# Altium project WashrProgV1.PrjPcb
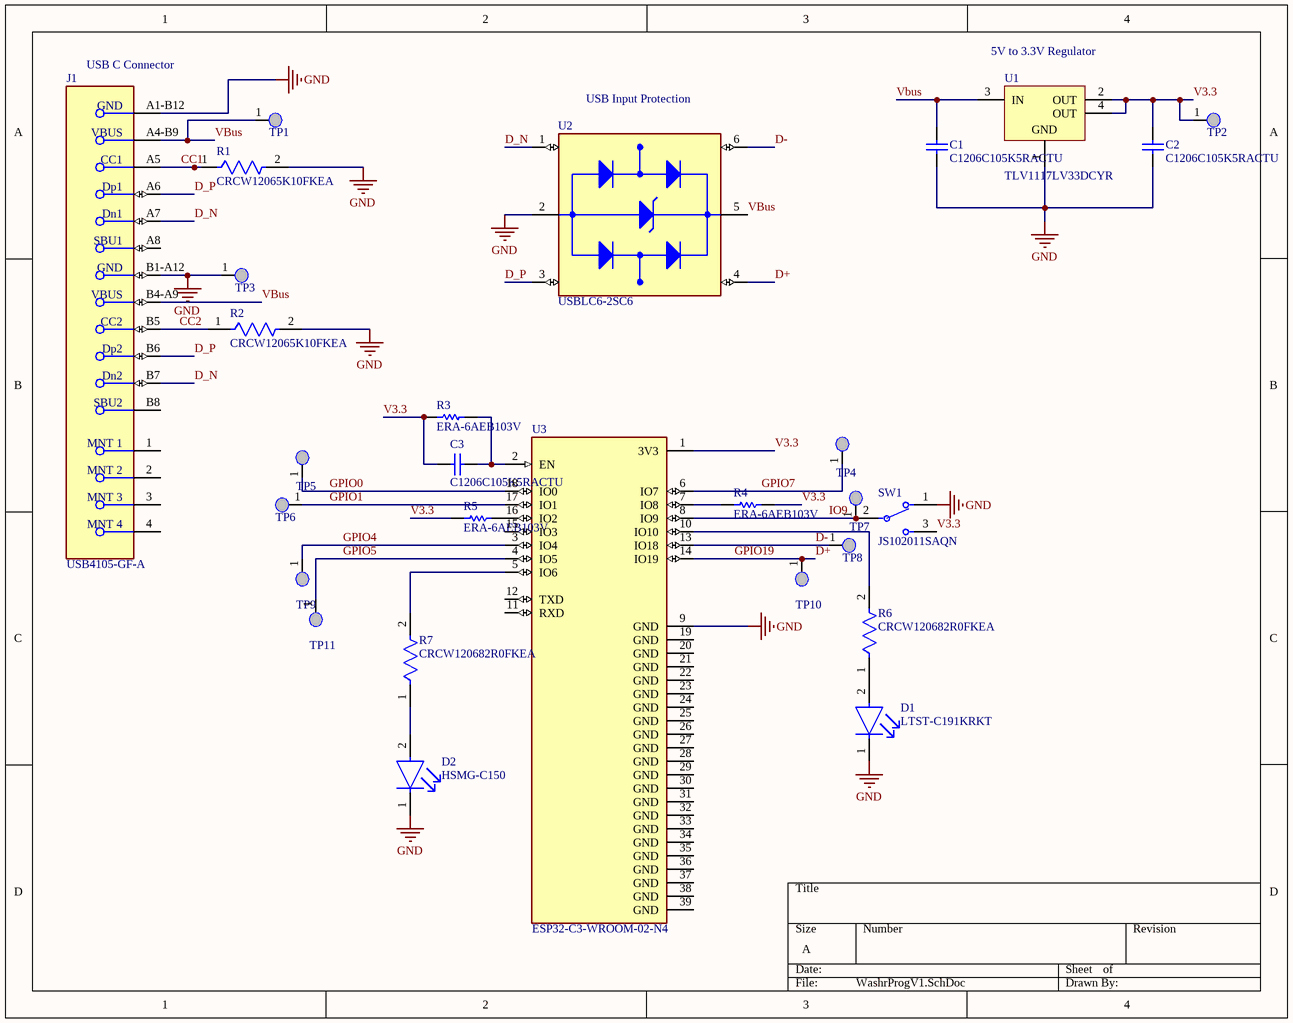
[diagram p0: WashrProgV1.SchDoc]
1 sheet, 28 parts. Net scope: global (net labels, ports and power ports of the same name join across sheets).
Board file: WashrProgV1.PcbDoc

## Sheet WashrProgV1.SchDoc
size A; SheetNumber: 1; SheetTotal: 1

### Parts
C1  C1206C105K5RACTU  [CAPC3216X110X50LL20T25]
C2  C1206C105K5RACTU  [CAPC3216X110X50LL20T25]
C3  C1206C105K5RACTU  [CAPC3216X110X50LL20T25]
D1  LTST-C191KRKT  [FP-LTST-C191KRKT-MFG]
D2  HSMG-C150  [FP-HSMG-C150-MFG]
J1  USB4105-GF-A  [FP-USB4105-GF-A-MFG]
R1  CRCW12065K10FKEA  [FP-CRCW1206-e3-IPC_C]
R2  CRCW12065K10FKEA  [FP-CRCW1206-e3-IPC_C]
R3  ERA-6AEB103V  [RESC2013X60X40LL20T25_A]
R4  ERA-6AEB103V  [RESC2013X60X40LL20T25_A]
R5  ERA-6AEB103V  [RESC2013X60X40LL20T25_A]
R6  CRCW120682R0FKEA  [FP-CRCW1206-e3-IPC_A]
R7  CRCW120682R0FKEA  [FP-CRCW1206-e3-IPC_A]
SW1  JS102011SAQN  [FP-JS102011SAQN-MFG]
TP1  Testpin  [PCBComponent_1]  (value not drawn)  (no BOM)
TP2  Testpin  [PCBComponent_1]  (value not drawn)  (no BOM)
TP3  Testpin  [PCBComponent_1]  (value not drawn)  (no BOM)
TP4  Testpin  [PCBComponent_1]  (value not drawn)  (no BOM)
TP5  Testpin  [PCBComponent_1]  (value not drawn)  (no BOM)
TP6  Testpin  [PCBComponent_1]  (value not drawn)  (no BOM)
TP7  Testpin  [PCBComponent_1]  (value not drawn)  (no BOM)
TP8  Testpin  [PCBComponent_1]  (value not drawn)  (no BOM)
TP9  Testpin  [PCBComponent_1]  (value not drawn)  (no BOM)
TP10  Testpin  [PCBComponent_1]  (value not drawn)  (no BOM)
TP11  Testpin  [PCBComponent_1]  (value not drawn)  (no BOM)
U1  TLV1117LV33DCYR  [DCY0004A_N]
U2  USBLC6-2SC6  [SOT95P280X145-6N]
U3  ESP32-C3-WROOM-02-N4  [MODULE_ESP32-C3-WROOM-02-H4]

### Nets
GND: C1.1 C2.1 D1.1(C) D2.1(C) J1.A1-B12(GND) J1.B1-A12(GND) R1.2 R2.2 SW1.1 TP3.1(TestPin) U1.1(GND) U2.2(GND) U3.9(GND)
CC1: J1.A5(CC1) R1.1
CC2: J1.B5(CC2) R2.1
D+: TP10.1(TestPin) U2.4(I/O2_OUT) U3.14(IO19)  [also labelled GPIO19]
D-: TP8.1(TestPin) U2.6(I/O1_OUT) U3.13(IO18)
D_N: J1.A7(Dn1) J1.B7(Dn2) U2.1(I/O1_IN)
D_P: J1.A6(Dp1) J1.B6(Dp2) U2.3(I/O2_IN)
GPIO0: TP5.1(TestPin) U3.18(IO0)
GPIO1: TP6.1(TestPin) U3.17(IO1)
GPIO4: TP9.1(TestPin) U3.3(IO4)
GPIO5: TP11.1(TestPin) U3.4(IO5)
GPIO7: TP4.1(TestPin) U3.6(IO7)
IO9: SW1.2(C) TP7.1(TestPin) U3.8(IO9)
V3.3: C2.2 C3.2 R3.1 R4.2 R5.2 SW1.3 TP2.1(TestPin) U1.2(OUT) U1.4(OUT) U3.1(3V3)
VBus: C1.2 J1.A4-B9(VBUS) J1.B4-A9(VBUS) TP1.1(TestPin) U1.3(IN) U2.5(VBUS)
NetC3_1: C3.1 R3.2 U3.2(EN)
NetD1_2: D1.2(A) R6.1
NetD2_2: D2.2(A) R7.1
NetR4_1: R4.1 U3.7(IO8)
NetR5_1: R5.1 U3.16(IO2)
NetR6_2: R6.2 U3.10(IO10)
NetR7_2: R7.2 U3.5(IO6)

Not connected (* = marked no-connect by the designer): J1 1(MNT_1) 2(MNT_2) 3(MNT_3) 4(MNT_4) A8(SBU1) B8(SBU2); U3 11(RXD) 12(TXD) 15(IO3) 19(GND) 20(GND) 21(GND) 22(GND) 23(GND) 24(GND) 25(GND) 26(GND) 27(GND) 28(GND) 29(GND) 30(GND) 31(GND) 32(GND) 33(GND) 34(GND) 35(GND) 36(GND) 37(GND) 38(GND) 39(GND)

### Notes on the sheet
- (near J1) USB C Connector
- (near U2) USB Input Protection
- (near U1) 5V to 3.3V Regulator

### Library data of the parts
C1-C3 = CMP-2000-06011-1: Chip Capacitor, 1 uF, +/- 10%, 50 V, -55 to 125 degC, 1206 (3216 Metric), RoHS, Tape and Reel; Manufacturer: Kemet; Case Height: 1mm; Dielectric: X7R; Voltage Rating: 50V; Capacitance: 1uF; Temperature Coefficient / Code: +/-15%; Case Length: 3.2mm; Case Width: 1.6mm; Type: SMDMLCCX7R6.3-250VDCCommericalGrade; Class: Class1; Capacitance - nF: 1000nF; Datasheet URL: http://www.kemet.com/docfinder?Partnumber=C1206C105K5RACTU; Product Category: MultilayerCeramicCapacitorsMLCC-SMD/SMT; Termination Style: SMD/SMT; Dimensions: 1.6mmWx3.2mmLx1mmH; Voltage Rating DC: 50V; Datasheet Version: 02/2016; Packaging: Reel; Brand: Kemet; RoHS: Details; Minimum Operating Temperature: -55C; Operating Temperature Range: -55Cto+125C; Package Reference: 1206; Manufacturer URL: http://www.kemet.com/; Product: GeneralTypeMLCCs; Tolerance: 10%; Package Description: 2-Pin Surface Mount Device, Body 3.2 x 1.6 mm; Mounting Technology: SurfaceMount; Case Code - mm: 3216; Maximum Operating Temperature: +125C; Series: C1206C; Factory Pack Quantity: 2500; Package / Case: 1206(3216metric); Case Code - in: 1206
D1 = CMP-2000-05199-2: NexarPartId: 549908; Illumination Color: Red; Lens Transparency: Clear; Luminous Intensity: 54mcd; Current: 2A; Forward Current: 20mA; Number of Elements: 1; Power Rating: 75mW; Lens Color: Colorless; Wavelength: 639nm; Viewing Angle: 130°; Voltage: 2V; Dominant Wavelength: 631nm; Reverse Voltage: 5V; Height: 550µm; Length: 1.6mm; Number of Pins: 2; Packaging: Tape and Reel; Mount: Surface Mount; Case Code (Metric): 1608; Radiation Hardening: No; Case Code (Imperial): 0603; Test Current: 20mA; Number of LEDs: 1; Schedule B: 8541402000, 8541402000; Lead Free: Lead Free; Power Dissipation: 75mW; RoHS: Compliant; Forward Voltage: 2V; Lens Style: Clear; Color: Red; Max Operating Temperature: 85°C; Depth: 800µm; Width: 800µm; Min Operating Temperature: -55°C; Case/Package: 0603
D2 = CMP-2000-05061-2: LED GREEN DIFFUSED 1206 SMD; Manufacturer: Broadcom; Led Orientation: Top View; Max Junction Temp: +95°C; Peak Emmision Wavelength: 570nm; Viewing Angle: 170°; Wavelength: 572nm; Reverse Voltage: 5V; Luminous Intensity: 15mcd; Description: Surface Mount Chip LEDs; Forward Voltage: 2.2V; Power Dissipation: 65mW; Forward Current: 20mA; ComponentLink2Description: Datasheet; Lead Free: Yes; Temperature Range Low: -40°C; Package: HSMG-C150; Digikey Description: LED GREEN DIFFUSED 1206 SMD; Mouser Description: LED Uni-Color Green 570nm 2-Pin Chip LED T/R; Manufacturer Part Number: HSMG-C150; Temperature Range High: +85°C; Device Class L1: Optoelectronics; Colour: Green; Category: Diode; Device Class L3: unset; RoHS: TRUE; Height: 1.2mm; ComponentLink2URL: https://docs.broadcom.com/docs/AV02-0551EN; Device Class L2: LEDs; Automotive: No; Ipc Land Pattern Name: DIOCP320160X55; Octopart: https://octopart.com/hsmg-c150-broadcom-71131304; Temperature: -40°C to +85°C
J1 = CMP-245163-000001-1: CONN RCPT USB2.0 TYPEC 5A; Manufacturer: GCT; Voltage Rating: 20V; Is Female: yes; Current Rating: 5/6.25/1.25/0.25A; Number Of Contacts: 16; Conn Orientation: Right Angle; Device Class L1: Connectors; Category: Conn; Lead Free: Yes; RoHS: TRUE; Temperature Range High: +85°C; Digikey Description: CONN RCPT USB2.0 TYPEC 5A; Device Class L3: unset; ComponentLink2Description: Datasheet; Manufacturer Part Number: USB4105-GF-A; Package: 0; Usb Standard: USB 2.0; Device Class L2: USB Connectors; Automotive: No; Temperature Range Low: -40°C; Height: 3.46mm; Temperature: -40°C to +85°C; Contact Material: Gold,Nickel; ComponentLink2URL: https://gct.co/files/drawings/usb4105.pdf; Octopart: https://octopart.com/usb4105-gf-a-gct-106627878
R1 R2 = CMP-1014-00590-3: RES Thick Film, 5.1kΩ, 1%, 0.25W, 100ppm/°C, 1206; Voltage Rating (DC): 200V; Max Power Dissipation: 250mW; Resistance: 5.1kR; Features: Automotive AEC-Q200; Weight: 0.000353oz; Case Code (Imperial): 1206; Case/Package: 1206; Min Operating Temperature: -55°C; Max Operating Temperature: 155°C; Height: 0.55mm; Termination: SMD/SMT; Case Code (Metric): 3216; Power Rating: 250mW; Lead Free: Lead Free; Contact Plating: Tin; Tolerance: 1%; Depth: 1.6mm; Composition: Thick Film; Radiation Hardening: No; Military Standard: Not; Packaging: Tape and Reel; Width: 1.6mm; Voltage Rating: 200V; Package Quantity: 10; Temperature Coefficient: 100ppm/°C; Length: 3.2mm; Number of Terminations: 2
R3-R5 = CMP-2001-00582-2: Metal Film Chip Resistor, High Reliability Type, 0.125 W, +/- 0.1%, -55 to 155 degC, 0805 (2012 Metric), RoHS, Tape and Reel; Voltage Rating: 100V; Power Rating: 125mW(1/8W); Brand: Panasonic; Temperature Coefficient: 25PPM/C; Resistance: 10kOhms; Product Category: ThinFilmResistors-SMD; Datasheet Version: 02/2016; Operating Temperature Range: -55Cto+155C; Length: 2mm; Mounting Technology: SurfaceMount; Manufacturer URL: http://www.panasonic.com/; Width: 1.25mm; Packaging: Reel; Product: ThinFilmResistorsSMD; Package / Case: 0805(2012metric); Termination Style: SMD/SMT; Tolerance: 0.1%; Datasheet URL: https://industrial.panasonic.com/cdbs/www-data/pdf/RDM0000/AOA0000C307.pdf; Package Description: 2-Pin Surface Mount Device, Body 2 x 1.25 mm; Factory Pack Quantity: 5000; Series: ERA-6A; Case Code - mm: 2012; RoHS: Details; Package Reference: 0805; Height: 0.5mm; Manufacturer: Panasonic; Case Code - in: 0805; Type: MetalFilmChipResistors
R6 R7 = CMP-2003-02405-2: RES Thick Film, 82Ω, 1%, 0.25W, 100ppm/°C, 1206; Resistance: 82R; Max Power Dissipation: 250mW; Working Voltage: 200V; Contact Plating: Tin; Tolerance: 1%; Composition: Thick Film; Packaging: Tape and Reel; Lead Free: Lead Free; Number of Terminations: 2; Max Operating Temperature: 155°C; Features: Automotive AEC-Q200; Weight: 0.000353oz; Termination: SMD/SMT; Temperature Coefficient: 100ppm/°C; Package Quantity: 10; Case Code (Metric): 3216; Length: 3.2mm; Width: 0.063inch; Military Standard: Not; Number of Pins: 2; Power Rating: 250mW; Min Operating Temperature: -55°C; Depth: 1.6mm; Radiation Hardening: No; Voltage Rating: 200V; Case Code (Imperial): 1206; Height: 0.55mm; Voltage Rating (DC): 200V; Case/Package: 1206
SW1 = CMP-2000-06501-2: SWITCH SLIDE SPDT 300MA 6V; Switch Function: On-On; Illumination Type: Non-Illuminated; Switch Travel: 2mm; Contact Resistance: 70mR; Actuator Material: Nylon; Electrical Life: 5000Cycles; Actuator Type: Standard; Max Operating Temperature: 85°C; Housing Material: Nylon; Radiation Hardening: No; Max Voltage Rating (DC): 6V; Package Quantity: 1; Case/Package: 100; Actuator Length: 2mm; Min Operating Temperature: -40°C; Contact Current Rating: 300mA; REACH SVHC: No SVHC; Throw Configuration: SPDT; Packaging: Tape and Reel; Contact Material: Copper Alloy; Max Current Rating: 300mA; Current Rating: 300mA; Mount: Surface Mount; Lead Free: Lead Free; Termination: Gull Wing; Voltage Rating (DC): 6V; Length: 9mm; Orientation: Right Angle; Contact Plating: Silver
TP1-TP11 = Testpin1
U1 = CMP-0395-00503-2: Single Output LDO, 1 A, Fixed 3.3 V Output, 2 to 5.5 V Input, 4-pin SOT-223 (DCY), -40 to 125 degC, Green (RoHS & no Sb/Br); Manufacturer: Texas Instruments; Vout Adj(Min)(V): 3.3; Vdo(Typ)(mV): 1200; Iq(Typ)(mA): 0.05; Accuracy(%): 2; Iout(Max)(A): 1; SubFamily: Single Channel LDO; Vin(Max)(V): 5.5; PackageReference: DCY0004A; PackageDescription: 4-Pin Plastic Small Outline, Body 3.5 x 6.5 mm, Pitch 2.3 mm; Vout Adj(Max)(V): 3.3; Mounting Technology: Surface Mount; ComponentLink2Description: Datasheet; ComponentLink1Description: Manufacturer URL; PartNumber: TLV1117LV33DCYR; ComponentLink3Description: Package Specification; ComponentLink1URL: http://www.ti.com/; ComponentLink2URL: http://www.ti.com/general/docs/lit/getliterature.tsp?genericPartNumber=TLV1117LV33&fileType=pdf; Fixed Output Options(V): 3.3; PackageVersion: 4202506/B; Vin(Min)(V): 2; DatasheetVersion: SBVS160A; Eco-Plan: Green (RoHS & no Sb/Br); ComponentLink3URL: http://www.ti.com/litv/pdf/mpds094a; Code_JEDEC: TO-261
U2 = USBLC6-2SC6: 17V Clamp 5A (8/20Âµs) Ipp Tvs Diode Surface Mount SOT-23-6; MF: STMicroelectronics; Value: *; SnapEDA_Link: https://www.snapeda.com/parts/USBLC6-2SC6/STMicroelectronics/view-part/?ref=snap; Check_prices: https://www.snapeda.com/parts/USBLC6-2SC6/STMicroelectronics/view-part/?ref=eda; Purchase-URL: https://pricing.snapeda.com/search/part/USBLC6-2SC6/?ref=eda; Price: None; Availability: In Stock; Package: SOT-23-6 STMicroelectronics; MP: USBLC6-2SC6; Supplier 1: Future Electronics; Supplier Part Number 1: 7967441
U3 = ESP32-C3-WROOM-02-N4: WiFi Modules (802.11) (Engineering Samples) SMD module, ESP32-C3, 4MB SPI flash, PCB antenna, -40 C +85 C; MF: Espressif Systems; Value: *; SnapEDA_Link: https://www.snapeda.com/parts/ESP32-C3-WROOM-02-N4/Espressif+Systems/view-part/?ref=snap; Purchase-URL: https://pricing.snapeda.com/search/part/ESP32-C3-WROOM-02-N4/?ref=eda; Availability: In Stock; Price: None; Package: Package; Check_prices: https://www.snapeda.com/parts/ESP32-C3-WROOM-02-N4/Espressif+Systems/view-part/?ref=eda; MP: ESP32-C3-WROOM-02-N4